# Altium project estop-lora-esp32.PrjPcb
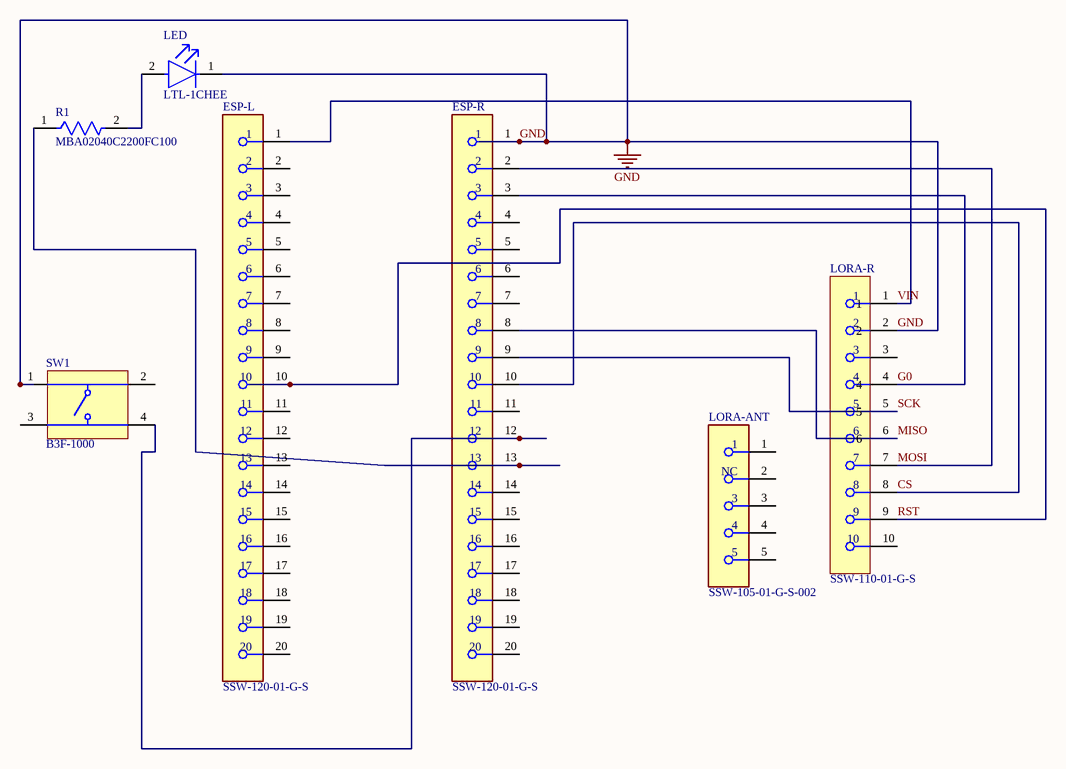
[diagram p0: estop-lora-esp32.SchDoc]
1 sheet, 7 parts. Net scope: global (net labels, ports and power ports of the same name join across sheets).
Board file: estop-lora-esp32.PcbDoc

## Sheet estop-lora-esp32.SchDoc
size A4; SheetNumber: 1; SheetTotal: 1

### Parts
ESP-L  SSW-120-01-G-S  [FP-SSW-120-01-G-S-MFG]
ESP-R  SSW-120-01-G-S  [FP-SSW-120-01-G-S-MFG]
LED  LTL-1CHEE  [FP-LTL-1CHEE-MFG]
LORA-ANT  SSW-105-01-G-S-002  [FP-SSW-105-01-G-S-002-MFG]
LORA-R  SSW-110-01-G-S  [FP-SSW-110-01-G-S-MFG]
R1  MBA02040C2200FC100  [FP-MBA0204-MFG]
SW1  B3F-1000  [OMRON-B3F-1000-4_V]

### Nets
GND: ESP-R.1 LED.1(C) LORA-R.2 SW1.1
CS: ESP-R.10 LORA-R.8
G0: ESP-R.3 LORA-R.4
MISO: ESP-R.8 LORA-R.6
MOSI: ESP-R.2 LORA-R.7
RST: ESP-L.10 LORA-R.9
SCK: ESP-R.9 LORA-R.5
VIN: ESP-L.1 LORA-R.1
NetESP-R_12: ESP-R.12 SW1.4
NetESP-R_13: ESP-R.13 R1.1
NetLED_2: LED.2(A) R1.2

Not connected (* = marked no-connect by the designer): ESP-L 2 3 4 5 6 7 8 9 11 12 13 14 15 16 17 18 19 20; ESP-R 4 5 6 7 11 14 15 16 17 18 19 20; LORA-ANT 1 2(NC) 3 4 5; LORA-R 3 10; SW1 2 3

### Library data of the parts
ESP-L ESP-R = CMP-00575-00296075-1: SSW-120-01-G-S SSW - Samtec 2.54mm Single Row Straight Socket Strip 8.5 Profile (mcv)(TO22); NexarPartId: 296075; Manufacturer Lifecycle Status: PRODUCTION; Number of Contacts: 20; Gender: Receptacle; Connector Type: Receptacle, Socket; Contact Resistance: 10mΩ; Voltage Rating: 550V; Voltage Rating (DC): 655V; Voltage Rating (AC): 465V; Current Rating: 6.9A; Lead Length: 2.64mm; Housing Material: Polymer; Lead Free: Lead Free; Depth: 2.41mm; Termination: Solder; Radiation Hardening: No; Contact Material: Bronze; Lead Pitch: 2.54mm; Number of Rows: 1; Orientation: Straight; Housing Color: Black; Max Voltage Rating (AC): 550V; RoHS: Compliant; Pitch: 2.54mm; Lifecycle Status: Production; Mount: Through Hole; Color: Black; REACH SVHC: No SVHC; Min Operating Temperature: -55°C; Contact Plating: Gold; Length: 51.31mm; Max Operating Temperature: 125°C; Max Current Rating: 6.9A; Number of Positions: 20
LED = CMP-22017-000040-1: LED RED CLEAR T/H; Viewing Angle: 45°; Power Dissipation: 100mW; Wavelength: 635nm; Number of LEDs: 1; Test Current: 10mA; Lens Style: Dome; Forward Current: 30mA; Forward Voltage: 2V; Luminous Intensity: 19mcd; Reverse Voltage: 5V; Dominant Wavelength: 625nm; RoHS Compliant: Yes; Mount: Through Hole; Diameter: 3.1mm; Package Quantity: 1000; Lens Transparency: Clear; Illumination Color: Red; Lens Color: Red; Max Operating Temperature: 100°C; Radiation Hardening: No; Case/Package: T; Width: 3.8mm; Length: 3.8mm; Depth: 3.8mm; Series: -; Number of Pins: 2; Number of Elements: 1; Height: 5.2mm; Max Power Dissipation: 100mW; Lead Free: Lead Free; Packaging: Bulk; Color: Red; Min Operating Temperature: -55°C
LORA-ANT = CMP-02766-000042-1: CONN RCPT 5POS 0.1 GOLD PCB; Manufacturer: Samtec; Pitch: 2.54mm; Conn Orientation: Vertical; Number Of Contacts: 4; Voltage Rating: 655V; Current Rating: 4.7A; Conn Gender: Female; Is Female: yes; RoHS: TRUE; Octopart: https://octopart.com/ssw-105-01-g-s-002-samtec-17275695; Digikey Description: CONN RCPT 5POS 0.1 GOLD PCB; Category: Conn; Number Of Rows: 1; ComponentLink2Description: Datasheet; Temperature: -55°C to +125°C; Temperature Range High: +125°C; ComponentLink2URL: http://suddendocs.samtec.com/prints/ssw-1xx-xx-xxx-x-xx-xxx-xx-mkt.pdf; Height: 8.64mm; Manufacturer Part Number: SSW-105-01-G-S-002; Contact Material: Gold,Nickel; Automotive: No; Device Class L1: Connectors; Lead Free: Yes; Package: HDR4; Temperature Range Low: -55°C; Footprint Url: http://suddendocs.samtec.com/prints/ssw-s.pdf; Device Class L3: unset; Device Class L2: Headers and Wire Housings
LORA-R = CMP-1272-00002-2: Manufacturer Lifecycle Status: PRODUCTION; NexarPartId: 296065; Gender: Receptacle; Number of Contacts: 10; Contact Resistance: 10mΩ; Voltage Rating (AC): 465V; Connector Type: Socket; Voltage Rating: 550V; Voltage Rating (DC): 655V; Pitch: 2.54mm; Max Current Rating: 6.9A; Lead Length: 2.64mm; Depth: 2.41mm; Termination: Solder; Contact Material: Bronze; Length: 25.91mm; REACH SVHC: No SVHC; Min Operating Temperature: -55°C; Max Voltage Rating (AC): 550V; Color: Black; Lead Pitch: 2.54mm; Packaging: Bulk; Lead Free: Lead Free; Orientation: Vertical; Housing Color: Black; Lifecycle Status: Production; Contact Plating: Gold; Radiation Hardening: No; Current Rating: 6.9A; Number of Positions: 10; Max Operating Temperature: 125°C; Number of Rows: 1; RoHS: Compliant
R1 = CMP-02408-000005-1: RES 220 OHM 0.4W 1% AXIAL; Manufacturer: Vishay BC Components; Automotive Grade: Grade 1; Value: 220Ω; Voltage Rating: 200V; Temperature Coefficient: 50ppm/°C; Power Rating: 0.25W; Digikey Description: RES 220 OHM 0.4W 1% AXIAL; Height: 1.6mm; Automotive: Yes; Lead Free: Yes; Mouser Description: Thin Film Resistors - Through Hole .4watt 220ohms 1% 1/8watt body size; Temperature Range Low: -55°C; ComponentLink2Description: Datasheet; Temperature: -55°C to +125°C; Device Class L3: Through-Hole Resistors; Manufacturer Part Number: MBA02040C2200FC100; Ipc Land Pattern Name: RESAD500W65L360D160; Octopart: https://octopart.com/mba02040c2200fc100-vishay-43743094; Series: MBA/SMA 0204; RoHS: TRUE; Tolerance: 1%; Package: MBA0204; Device Class L1: Passive Components; ComponentLink2URL: http://www.vishay.com/docs/28766/mbxsma.pdf; Category: Res; Composition: Metal Film; Device Class L2: Resistors; Temperature Range High: +125°C; Resistance: 220Ω
SW1 = CMP-1677-00002-1: Tactile Switch, SPST-NO, 0.05 A, 5 to 24 V, -25 to 70 degC, 4-Pin THD, RoHS, Bulk; Shielding: Shielded; Gender: Female; Capacitance: -45 f; Voltage Rating: 150 V; Current Rating: 1.5 A; Radiation Hardening: No; Contact Plating: Gold; Height: 14.99 mm; Min Operating Temperature: -40 degC; Packaging: Tray; ComponentLink2Description: Datasheet; ComponentLink1URL: http://www.omron.com/; Lead Pitch: 1.27 mm; RoHSCompliant: true; Pins: 8; PackageReference: B3F-1000; Width: 25.4 mm; Contact Material: Brass; ComponentLink2URL: http://www.omron.com/ecb/products/pdf/en-b3f.pdf; PackageDescription: 4-Pin Through Hole Device, Body 6 x 6 mm; DatasheetVersion: Jan-15; ComponentLink1Description: Manufacturer URL; Package Quantity: 1080; Mount: Through Hole; Length: 18.34 mm; Max Operating Temperature: 70 degC